# EAGLE design circuit (EAGLE 5.11)
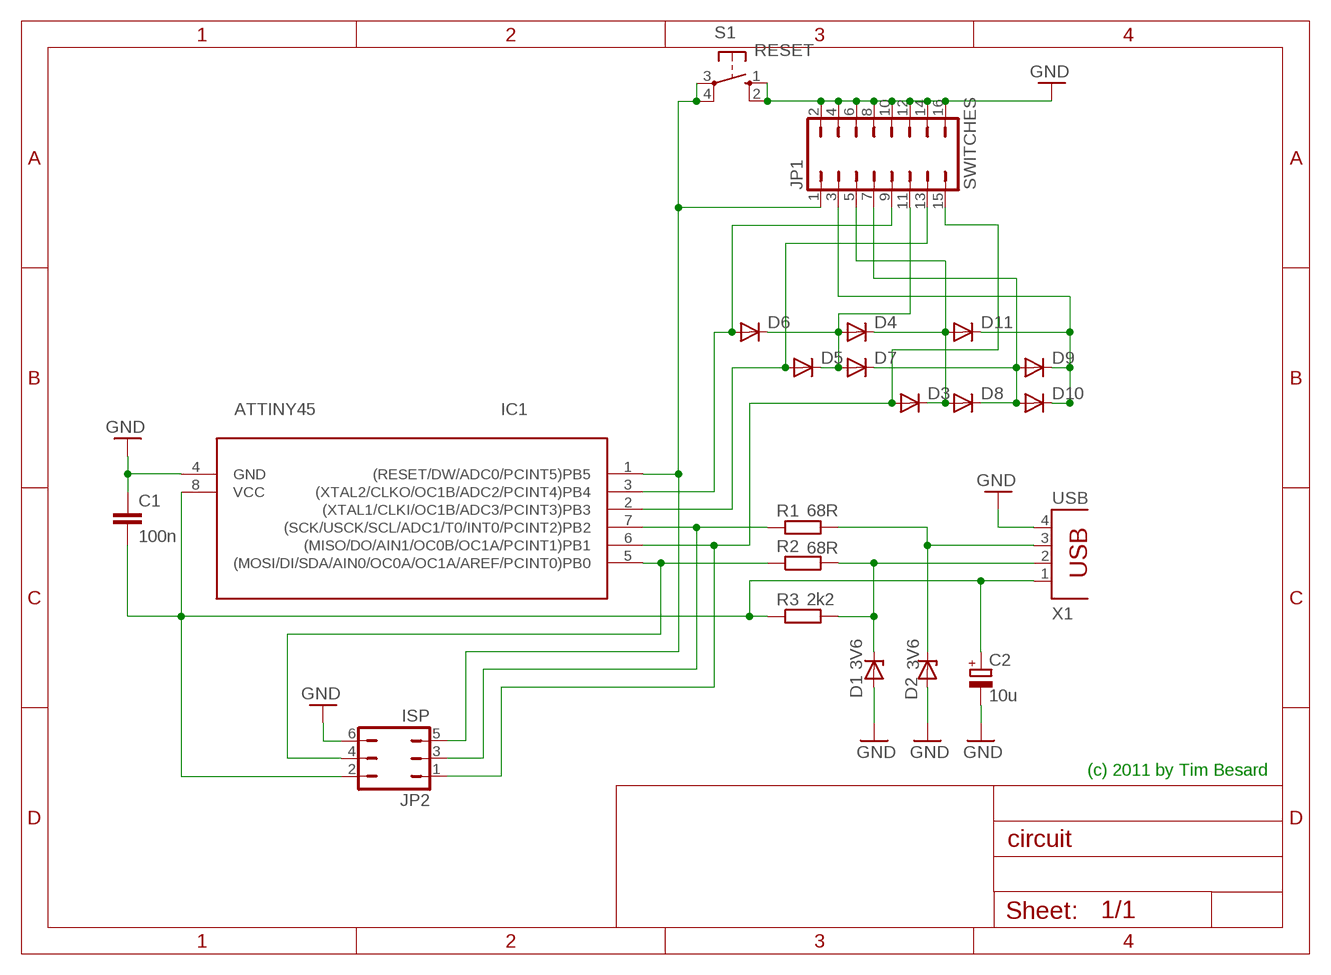
[diagram p0: schematic, sheet 1]

## Parts
C1  100n  C-EU025-025X050  [C025-025X050]
C2  10u  CPOL-EUE2,5-6E  [E2,5-6E]
D1  3V6  ZENER-DIODEZD-5  [ZDIO-5]
D2  3V6  ZENER-DIODEZD-5  [ZDIO-5]
D3  1N4148DO35-10  [DO35-10]
D4  1N4148DO35-10  [DO35-10]
D5  1N4148DO35-10  [DO35-10]
D6  1N4148DO35-10  [DO35-10]
D7  1N4148DO35-10  [DO35-10]
D8  1N4148DO35-10  [DO35-10]
D9  1N4148DO35-10  [DO35-10]
D10  1N4148DO35-10  [DO35-10]
D11  1N4148DO35-10  [DO35-10]
IC1  ATTINY45  ATTINY45-20P  [DIL08]
JP1  SWITCHES  JP8Q  [JP8Q]
JP2  ISP  JP3Q  [JP3Q]
R1  68R  R-EU_0207/10  [0207/10]
R2  68R  R-EU_0207/10  [0207/10]
R3  2k2  R-EU_0207/10  [0207/10]
S1  RESET  10-XX  [B3F-10XX]
X1  USB  PN61729  [PN61729]

## Nets
D+: D2.C R1.2 X1.3
D-: D1.C R2.2 R3.2 X1.2
GND: C1.1 C2.- D1.A D2.A IC1.4(GND) JP1.2 JP1.4 JP1.6 JP1.8 JP1.10 JP1.12 JP1.14 JP1.16 JP2.6 S1.1(S) S1.2(S1) X1.4
N$1: IC1.5((MOSI/DI/SDA/AIN0/OC0A/OC1A/AREF/PCINT0)PB0) JP2.4 R2.1
N$2: IC1.7((SCK/USCK/SCL/ADC1/T0/INT0/PCINT2)PB2) JP2.3 R1.1
N$3: D3.A IC1.6((MISO/DO/AIN1/OC0B/OC1A/PCINT1)PB1) JP1.15 JP2.1
N$5: IC1.1((RESET/DW/ADC0/PCINT5)PB5) JP1.1 JP2.5 S1.3(P) S1.4(P1)
N$6: D5.A IC1.2((XTAL1/CLKI/OC1B/ADC3/PCINT3)PB3) JP1.13
N$7: D6.A IC1.3((XTAL2/CLKO/OC1B/ADC2/PCINT4)PB4) JP1.9
N$13: D3.C D4.C D8.A D11.A JP1.5
N$14: D4.A D5.C D6.C D7.A JP1.11
N$15: D9.C D10.C D11.C JP1.3
N$16: D7.C D8.C D9.A D10.A JP1.7
VCC: C1.2 C2.+ IC1.8(VCC) JP2.2 R3.1 X1.1

## Notes on the sheet
- (c) 2011 by Tim Besard

## Library data of the parts
C1 = rcl:C-EU: CAPACITOR, European symbol
C2 = rcl:CPOL-EU: POLARIZED CAPACITOR, European symbol
D1 D2 = diode:ZENER-DIODE: Z-Diode
D3-D11 = diode:1N4148: DIODE high speed (Philips)
IC1 = avr:ATTINY45: MICROCONTROLLER 4 Kbytes FLASH 256 bytes EEPROM 256 bytes RAM 4-channel 10 bit ADC USI
JP1 = jumper:JP8Q: JUMPER
JP2 = jumper:JP3Q: JUMPER
R1-R3 = rcl:R-EU_: RESISTOR, European symbol
S1 = switch-omron:10-XX: OMRON SWITCH
X1 = con-berg:PN61729: BERG USB connector

## Board
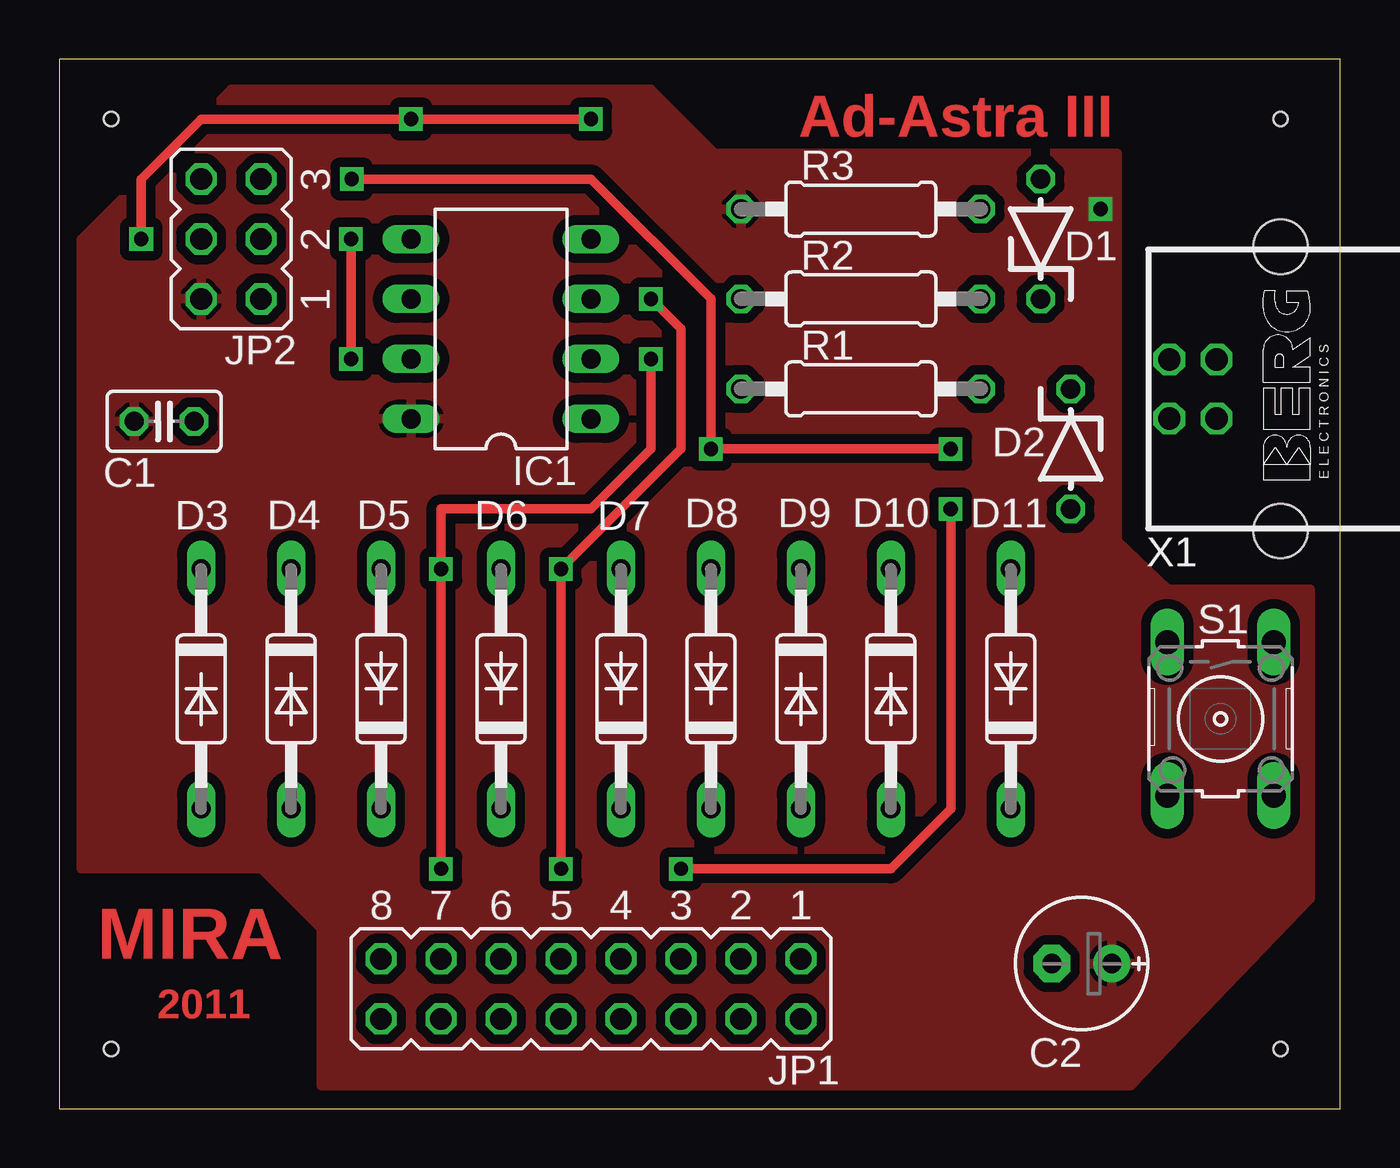
[diagram p1: board, top side]
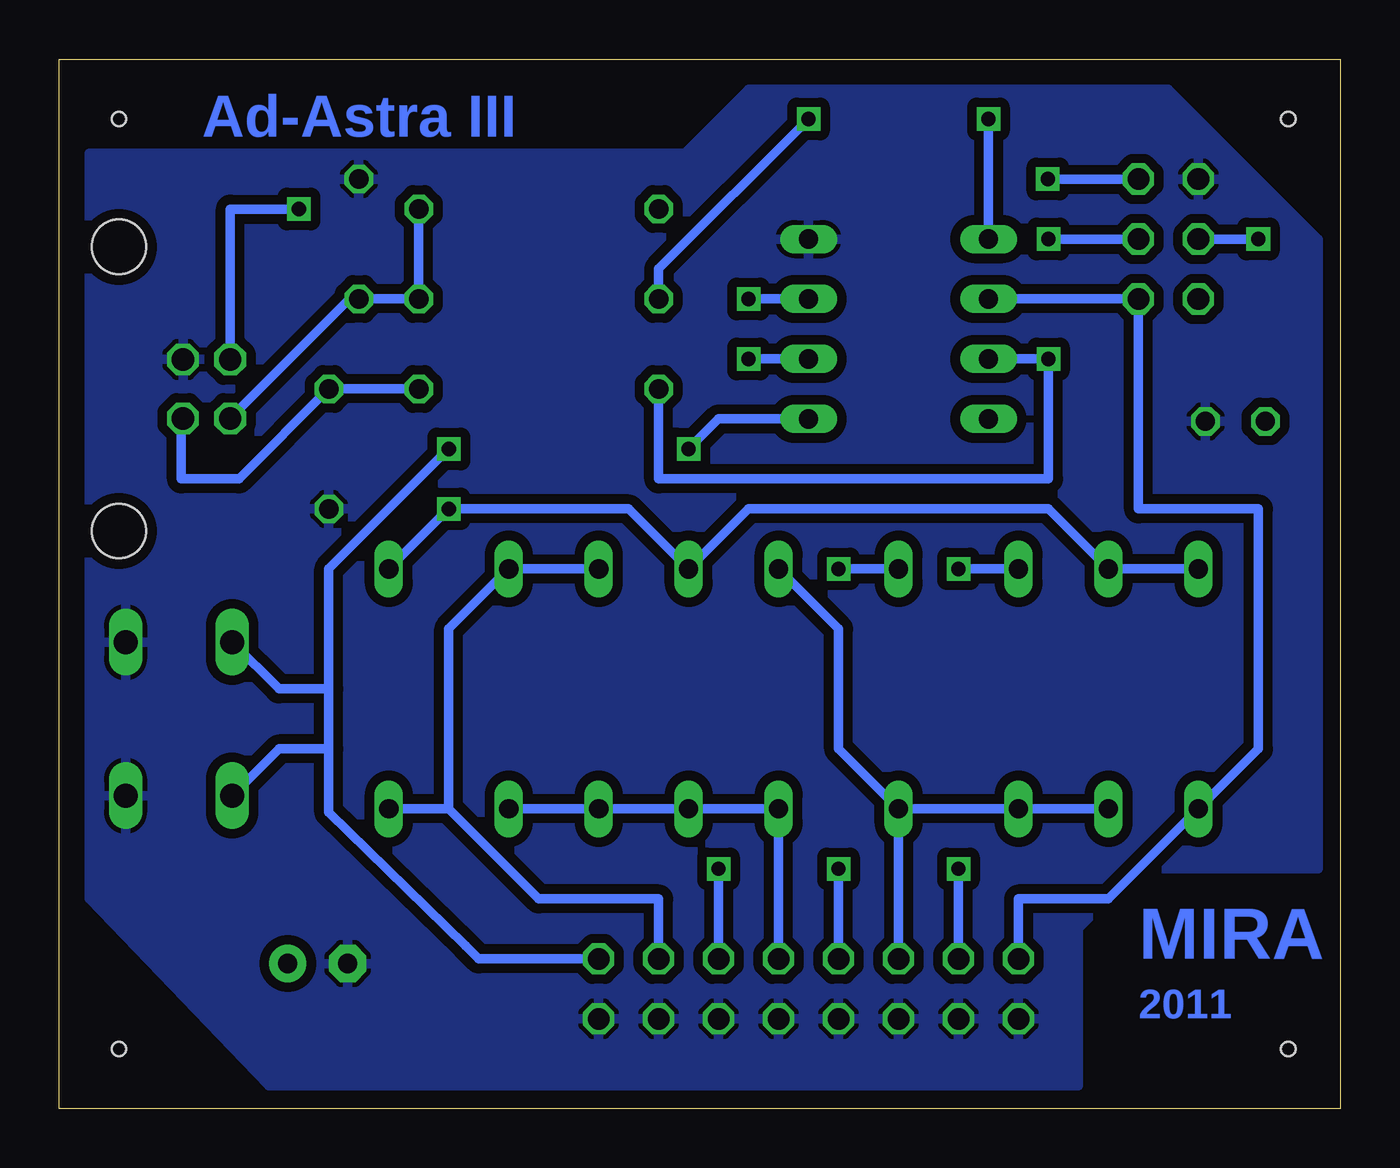
[diagram p2: board, bottom side, seen from below]

Size 54.28 x 44.44 mm. Coordinates in mm from the lower left corner, seen from the top.
Outline: 54.28,44.44 0,44.44 0,0 54.28,0 54.28,44.44
Copper layers (1*16): Top 0.018mm / dielectric 1.55mm / Bottom 0.018mm
Design rules "eC-STANDARD_pool-2-layer ": minimum track width 0.15mm, minimum drill 0.25mm, track to track 0.15mm, track to pad 0.15mm, pad to pad 0.15mm, via to via 0.15mm, smd to smd 0.15mm, copper to edge 0.45mm, drill to drill 0.3mm, minimum pad ring 0.2mm, minimum via ring 0.2mm, stop-mask expansion 0.1mm, vias tented up to drill 0mil, thermal gap 0.2mm
Holes 0.6 mm at 51.74,41.9 51.74,2.53 2.21,2.53 2.21,41.9

### Footprints (pad centres in the part's own frame; a part is rotated, then mirrored left to right if it is on the bottom)
C025-025X050 = drill 0.813 octagon: 1 -1.27,0; 2 1.27,0
E2,5-6E = drill 0.813 pad 1.575 round: + -1.27,0 | drill 0.813 pad 1.575 octagon: - 1.27,0
ZDIO-5 = drill 0.813 octagon: A 2.54,0; C -2.54,0
DO35-10 = drill 0.813 long: A 5.08,0; C -5.08,0
DIL08 = drill 0.813 long: 1 -3.81,-3.81; 2 -1.27,-3.81; 3 1.27,-3.81; 4 3.81,-3.81; 5 3.81,3.81; 6 1.27,3.81; 7 -1.27,3.81; 8 -3.81,3.81
JP8Q = drill 0.914 octagon: 1 -8.89,-1.27; 2 -8.89,1.27; 3 -6.35,-1.27; 4 -6.35,1.27; 5 -3.81,-1.27; 6 -3.81,1.27; 7 -1.27,-1.27; 8 -1.27,1.27; 9 1.27,-1.27; 10 1.27,1.27; 11 3.81,-1.27; 12 3.81,1.27; 13 6.35,-1.27; 14 6.35,1.27; 15 8.89,-1.27; 16 8.89,1.27
JP3Q = drill 0.914 octagon: 1 -2.54,-1.27; 2 -2.54,1.27; 3 0,-1.27; 4 0,1.27; 5 2.54,-1.27; 6 2.54,1.27
0207/10 = drill 0.813 octagon: 1 -5.08,0; 2 5.08,0
B3F-10XX = drill 1.016 long: 1 -3.251,2.261; 2 3.251,2.261; 3 -3.251,-2.261; 4 3.251,-2.261
PN61729 = drill 0.95 octagon: 1 1.25,4.71; 2 -1.25,4.71; 3 -1.25,2.71; 4 1.25,2.71 | hole 2.3: -6.02,0; 6.02,0

### Placement (x,y rotation side)
C1  4.45,29.1 180 top
C2  43.32,6.14 180 top
D1  41.58,36.82 90 top
D2  42.85,27.93 270 top
D3  6.02,17.77 270 top
D4  9.83,17.77 270 top
D5  13.64,17.77 90 top
D6  18.72,17.77 90 top
D7  23.8,17.77 90 top
D8  27.61,17.77 90 top
D9  31.42,17.77 270 top
D10  35.23,17.77 270 top
D11  40.31,17.77 90 top
IC1  18.72,33.01 90 top
JP1  22.53,5.07 180 top
JP2  7.29,36.82 90 top
R1  33.96,30.47 0 top
R2  33.96,34.28 0 top
R3  33.96,38.09 0 top
S1  49.2,16.5 270 top
X1  51.74,30.47 90 top

### Tracks (layer width: path | path; a pad name or v marks a point on that pad's centre or on a via)
D+
  Bottom 0.406: R1.2 D2.C 46.66,26.66 49.1,26.66 49.1,29.15 X1.3
D-
  Bottom 0.406: R3.2 R2.2 D1.C 41.97,34.28 X1.2
GND
  pour Bottom (isolate 0.406): 7.29,43.17 25.07,43.17 27.78,40.46 53.01,40.46 53.01,8.88 45.39,0.96 11.1,0.96 11.1,7.61 8.56,10.15 0.94,10.15 0.94,36.82
N$1  (via drill 0.6)
  Top 0.406: v3.48,36.82 3.48,39.36 6.02,41.9 v14.91,41.9 v22.53,41.9
  Bottom 0.406: v3.48,36.82 JP2.4 | v14.91,41.9 IC1.5 | R2.1 28.88,35.55 v22.53,41.9
N$2  (via drill 0.6)
  Top 0.406: v12.37,31.74 v12.37,36.82
  Bottom 0.406: v12.37,36.82 JP2.3 | IC1.7 v12.37,31.74 12.37,26.66 28.88,26.66 R1.1
N$3
  Bottom 0.406: IC1.6 JP2.1 8.56,25.39 3.48,25.39 3.48,15.23 D3.A 9.83,8.88 13.64,8.88 JP1.15
N$5  (via drill 0.6)
  Top 0.406: v12.4,39.36 22.53,39.36 27.61,34.28 v27.61,27.93 v37.77,27.93
  Bottom 0.406: JP1.1 36.5,6.34 37.06,6.9 42.85,12.54 42.85,15.23 | 42.85,15.23 42.85,17.77 | 42.85,17.77 42.85,22.85 v37.77,27.93 | S1.3 44.96,17.77 42.85,17.77 | S1.4 44.96,15.23 42.85,15.23 | v12.4,39.36 JP2.5 | IC1.1 26.34,29.2 v27.61,27.93
N$6  (via drill 0.6)
  Top 0.406: v25.07,31.74 25.07,27.93 22.53,25.39 16.18,25.39 v16.18,22.85 v16.18,10.15
  Bottom 0.406: v25.07,31.74 IC1.2 | v16.18,22.85 D5.A | JP1.13 v16.18,10.15
N$7  (via drill 0.6)
  Top 0.406: v25.07,34.28 26.34,33.01 26.34,27.93 v21.26,22.85 v21.26,10.15
  Bottom 0.406: v25.07,34.28 IC1.3 | v21.26,22.85 D6.A | JP1.9 v21.26,10.15
N$13  (via drill 0.6)
  Top 0.406: v37.77,25.39 37.77,12.69 35.23,10.15 v26.34,10.15
  Bottom 0.406: D3.C D4.C 12.37,25.39 25.07,25.39 D8.A 30.15,25.39 v37.77,25.39 D11.A | v26.34,10.15 JP1.5
N$14
  Bottom 0.406: D6.C D5.C D4.A | D6.C 21.26,15.23 21.26,20.31 D7.A | D6.C JP1.11
N$15
  Bottom 0.406: D9.C D10.C 37.77,20.31 37.77,12.69 | 37.77,12.69 D11.C | 37.77,12.69 33.96,8.88 28.88,8.88 JP1.3
N$16
  Bottom 0.406: D10.A D9.A D8.C D7.C JP1.7
VCC  (via drill 0.6)
  Bottom 0.406: X1.1 47.03,38.09 v44.12,38.09
  pour Top (isolate 0.406): 7.29,43.17 25.07,43.17 27.78,40.46 44.82,40.46 44.82,24.02 46.96,21.98 53.01,21.98 53.01,8.88 45.39,0.96 11.1,0.96 11.1,7.61 8.56,10.15 0.94,10.15 0.94,36.82

### Text on the board
Top: Ad-Astra III | MIRA | 2011
Bottom: Ad-Astra III | MIRA | 2011